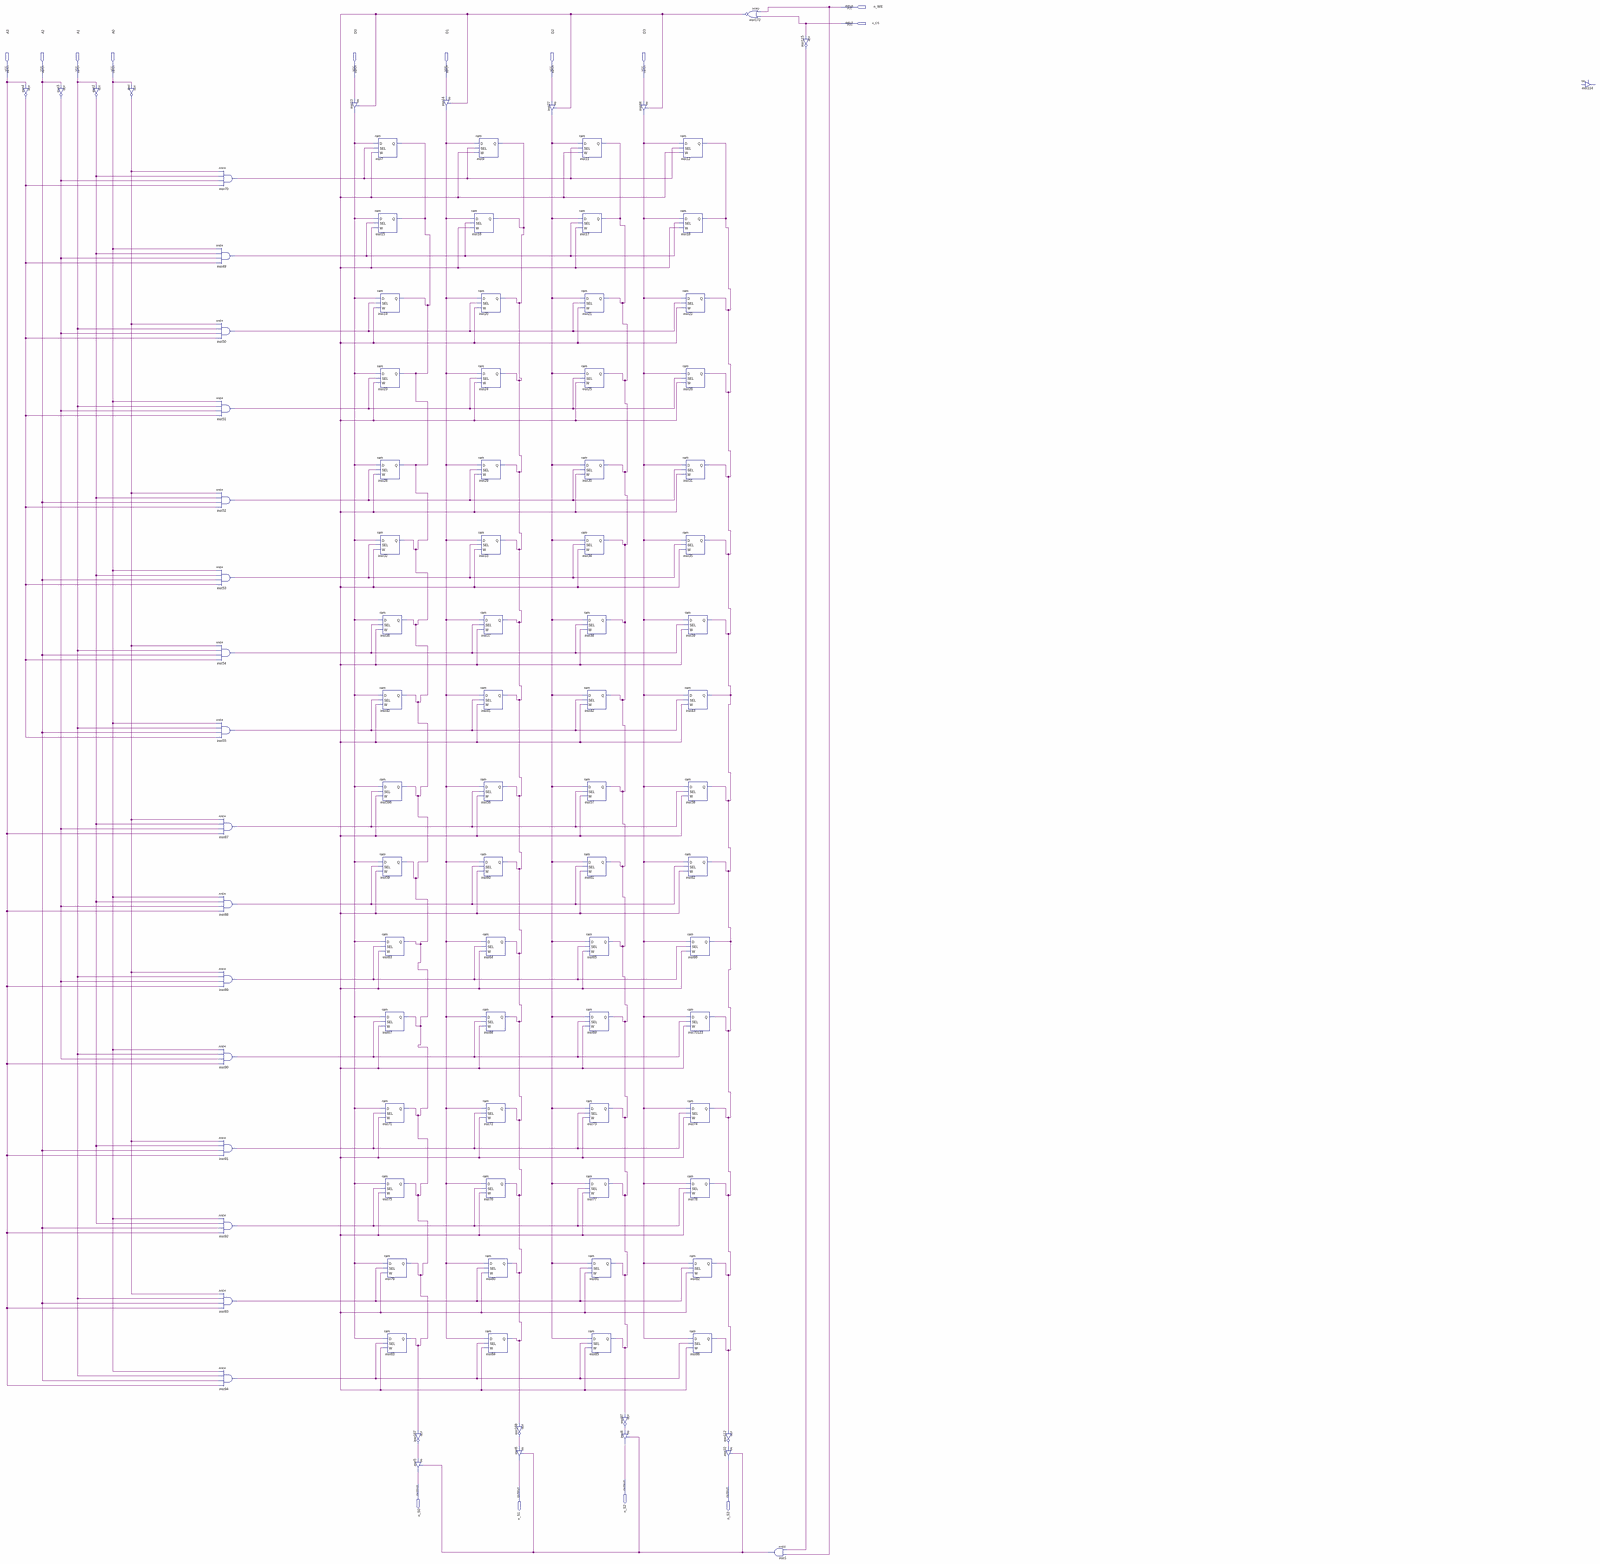
[diagram p0: schematic sheet, whole]
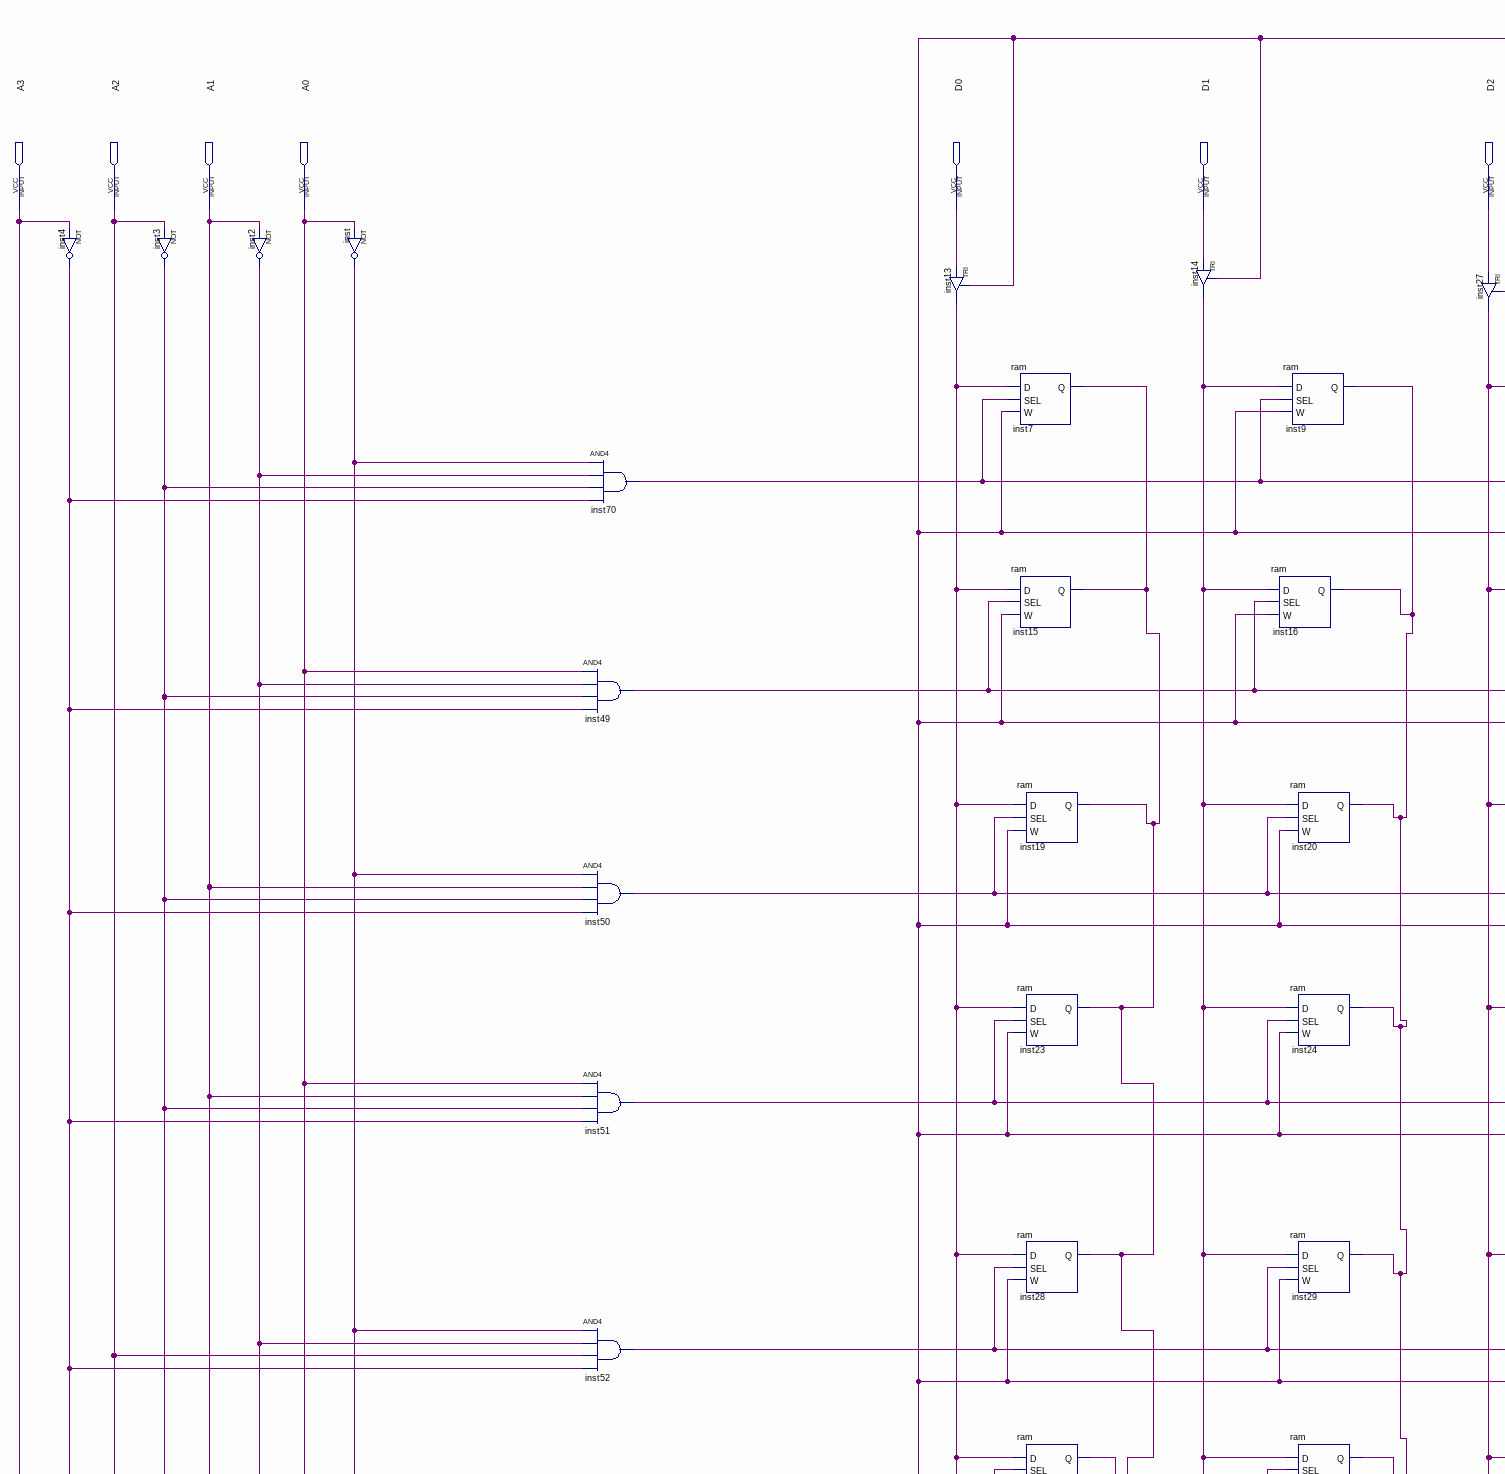
[diagram p1: schematic sheet, upper left part]
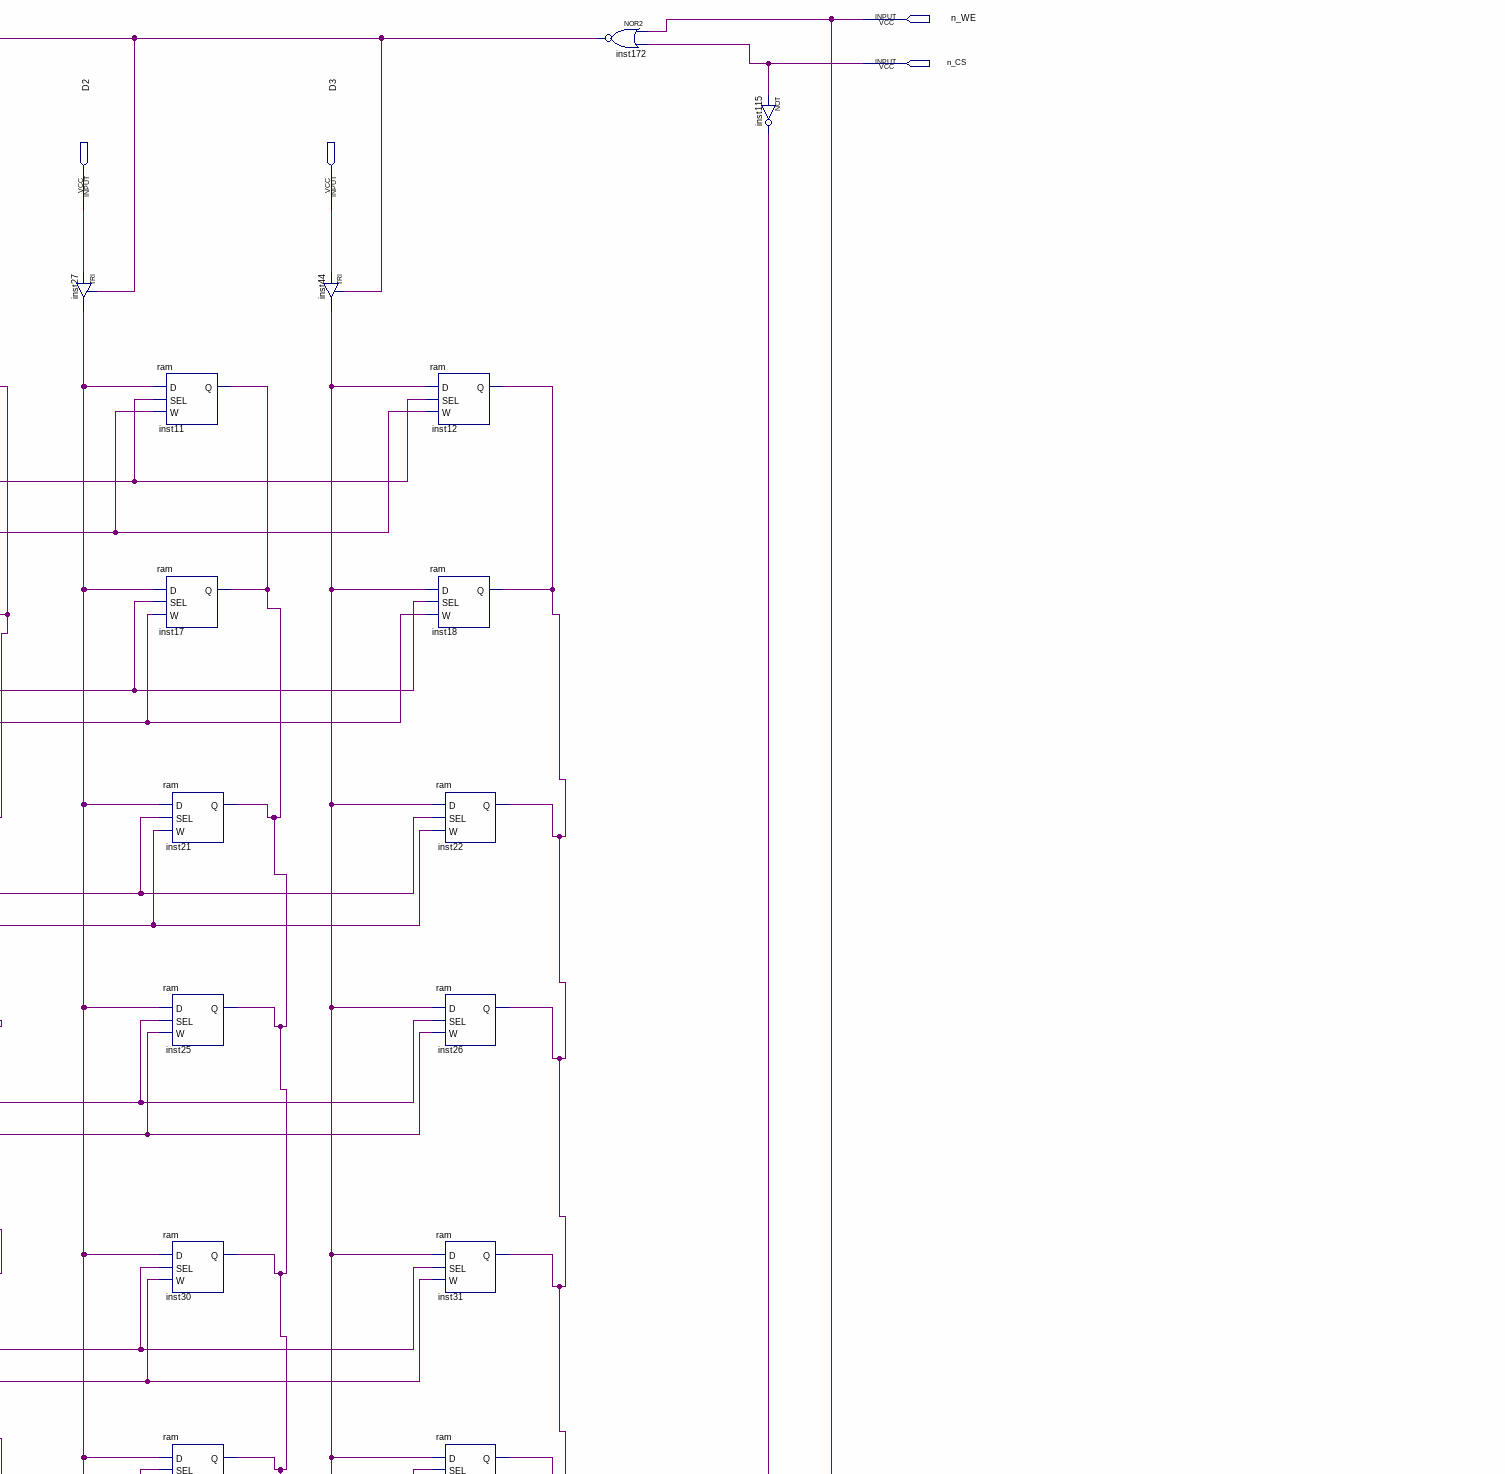
[diagram p2: schematic sheet, upper centre part]
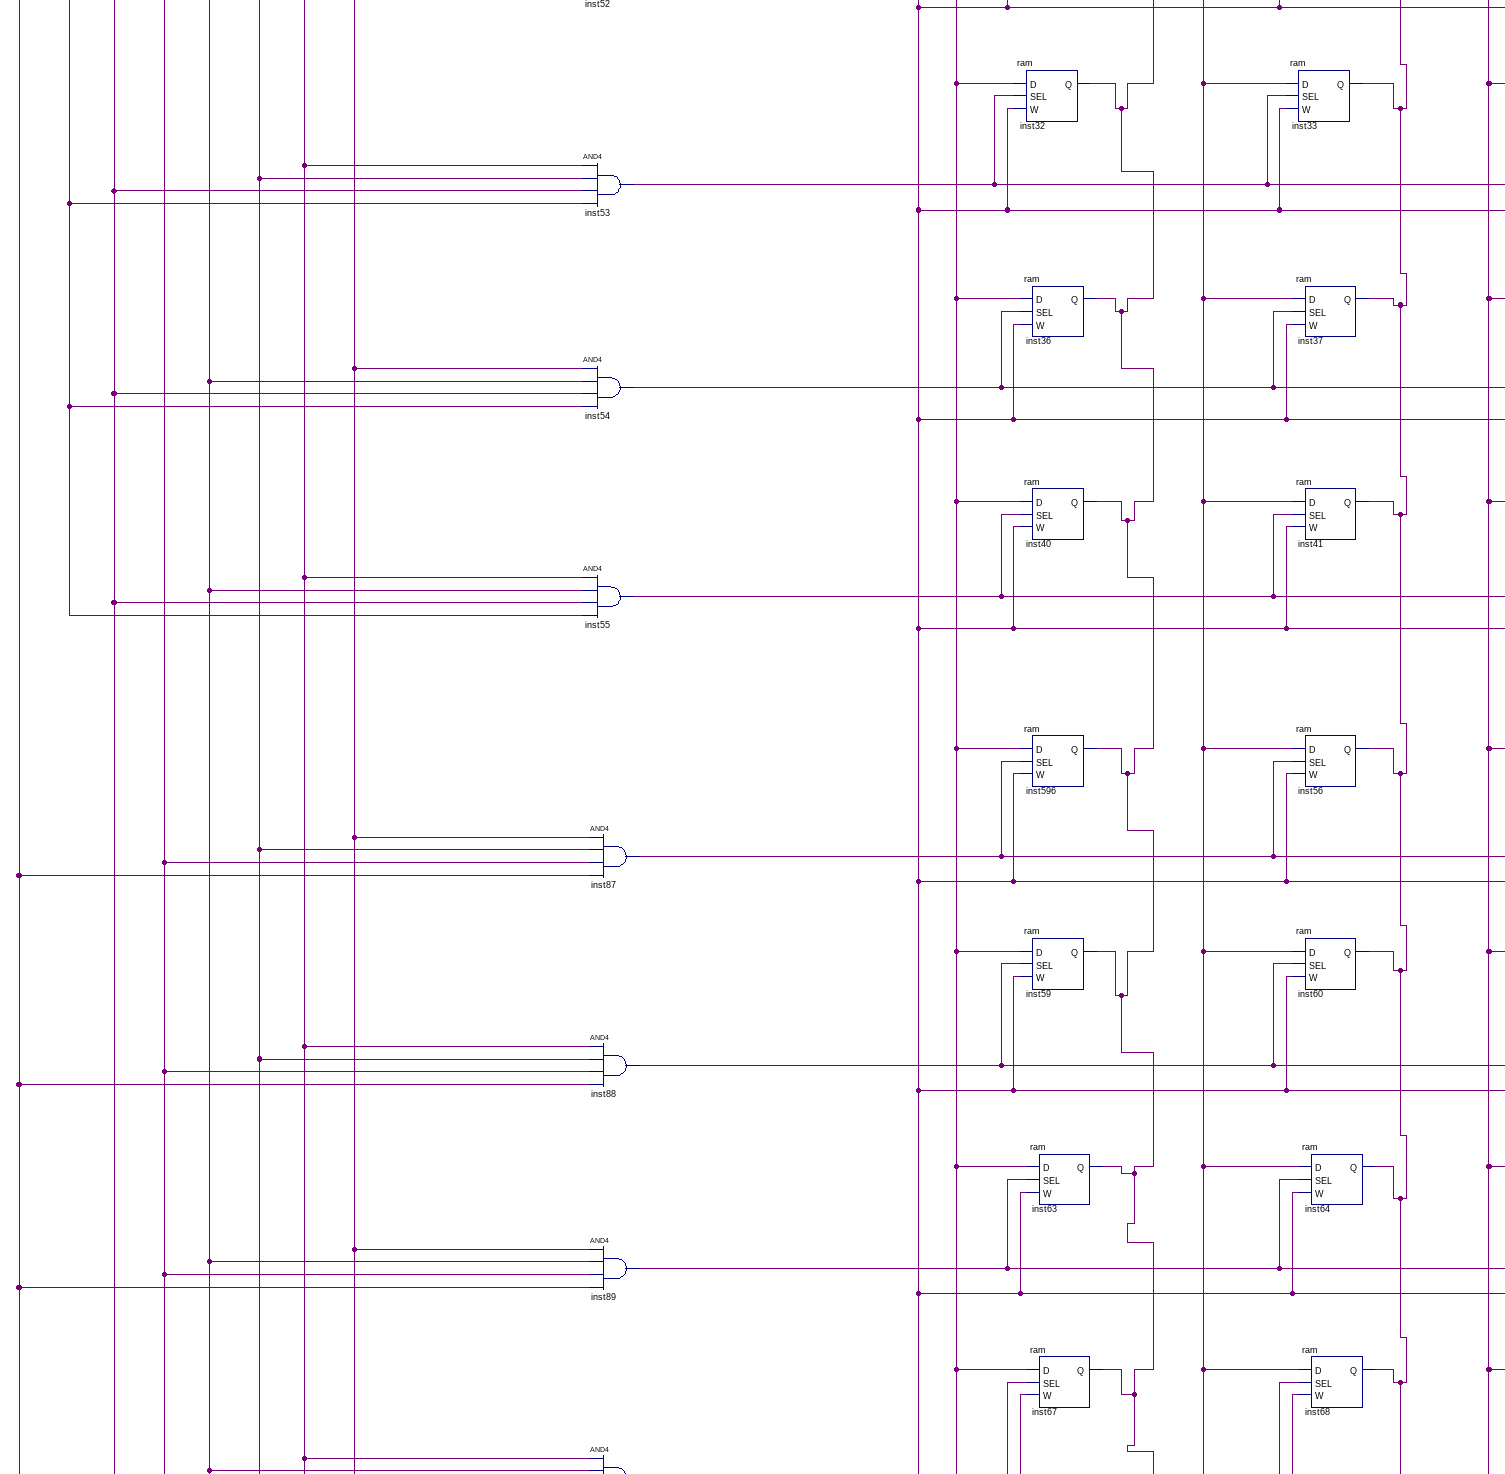
[diagram p3: schematic sheet, middle left part]
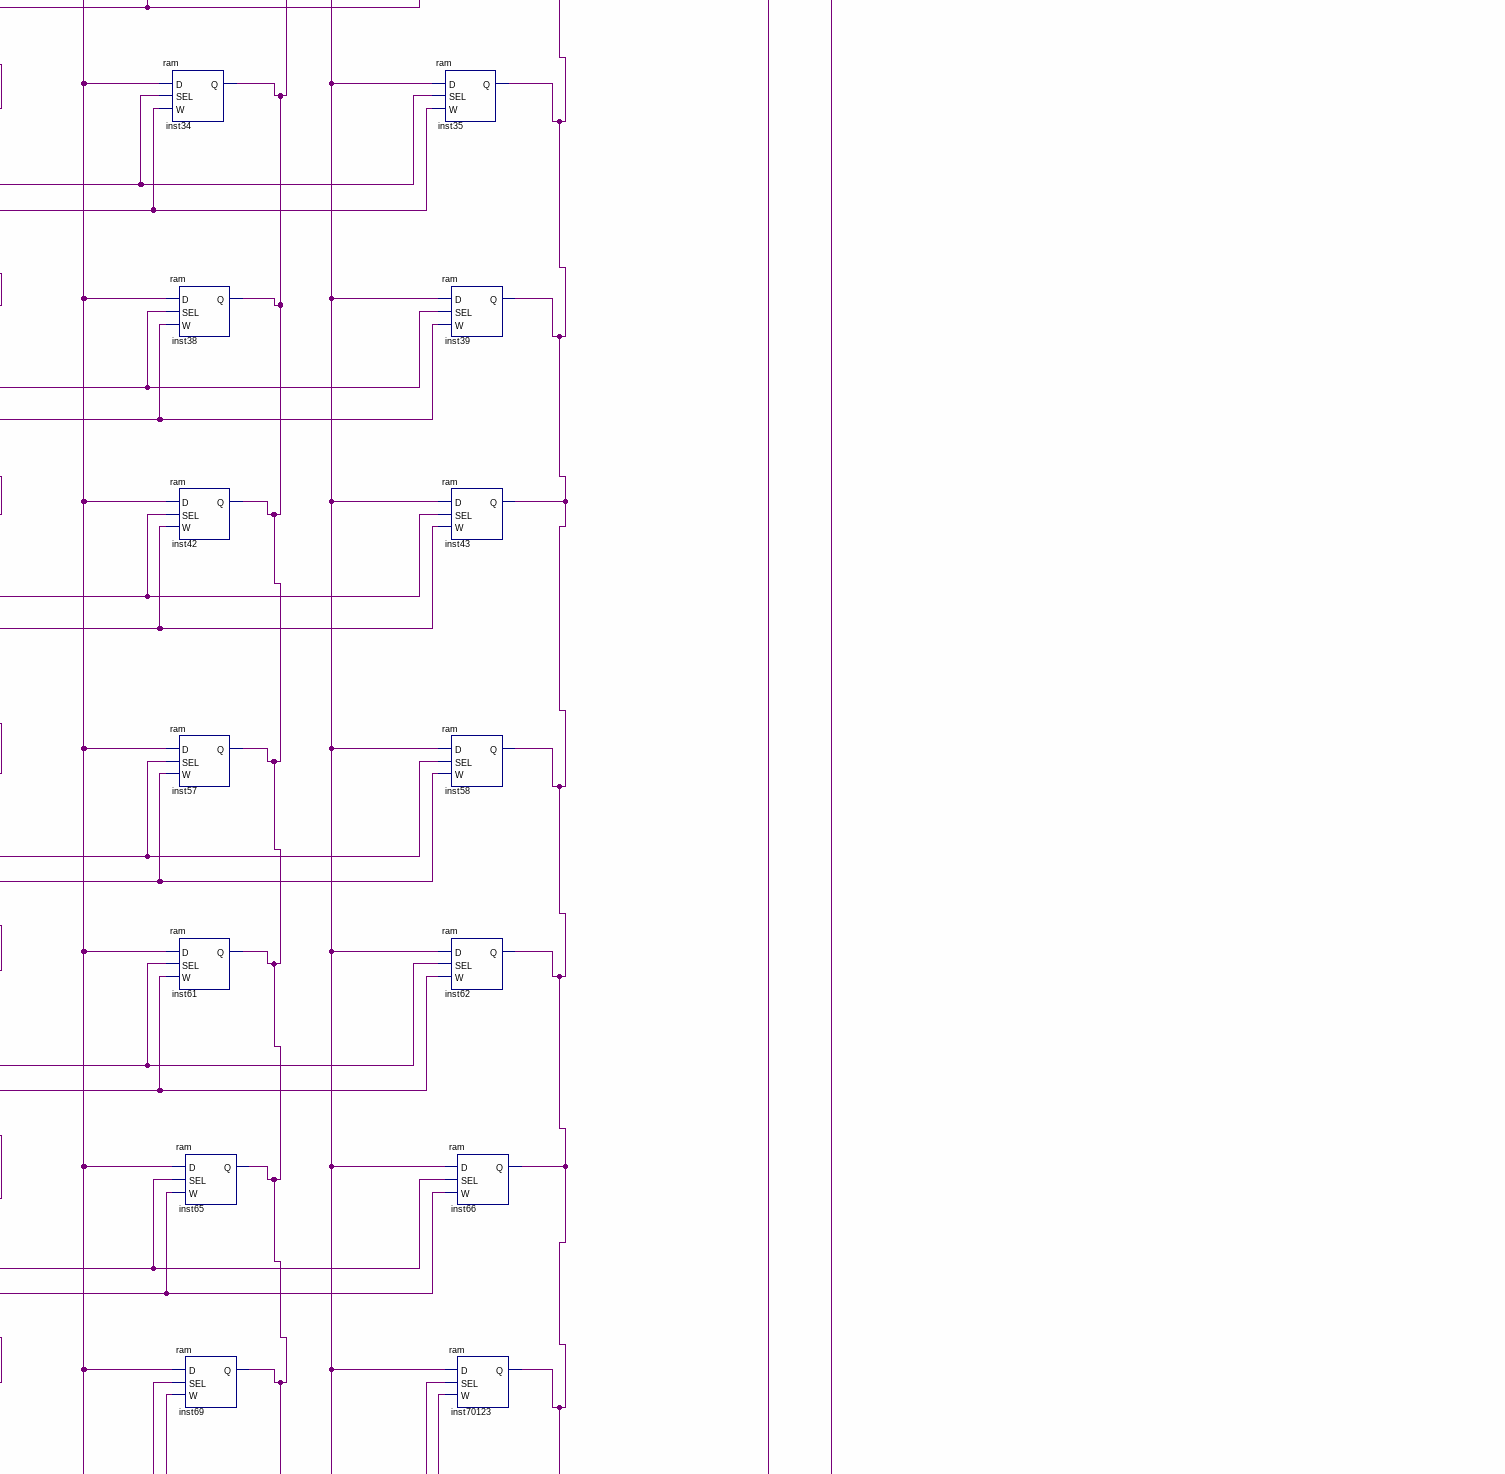
[diagram p4: schematic sheet, middle centre part]
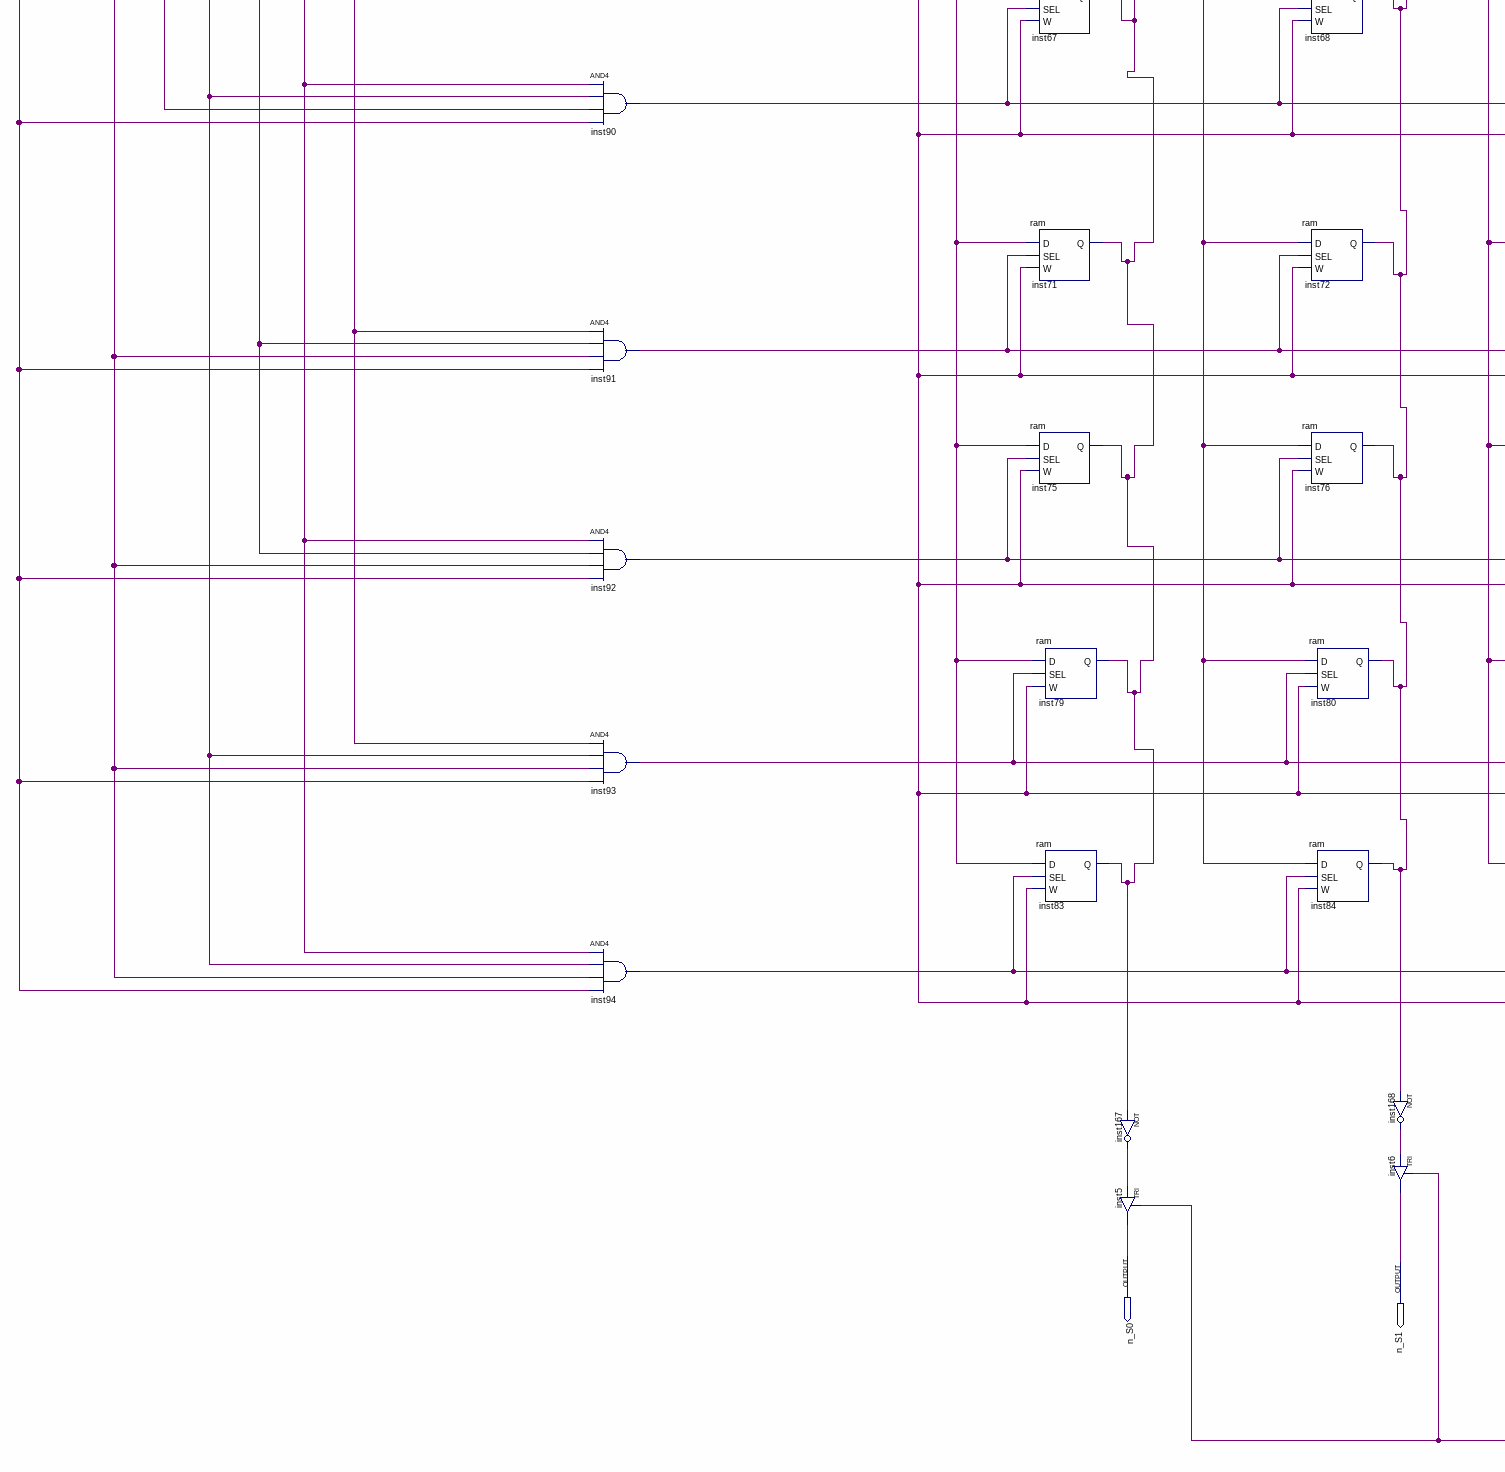
[diagram p5: schematic sheet, lower left part]
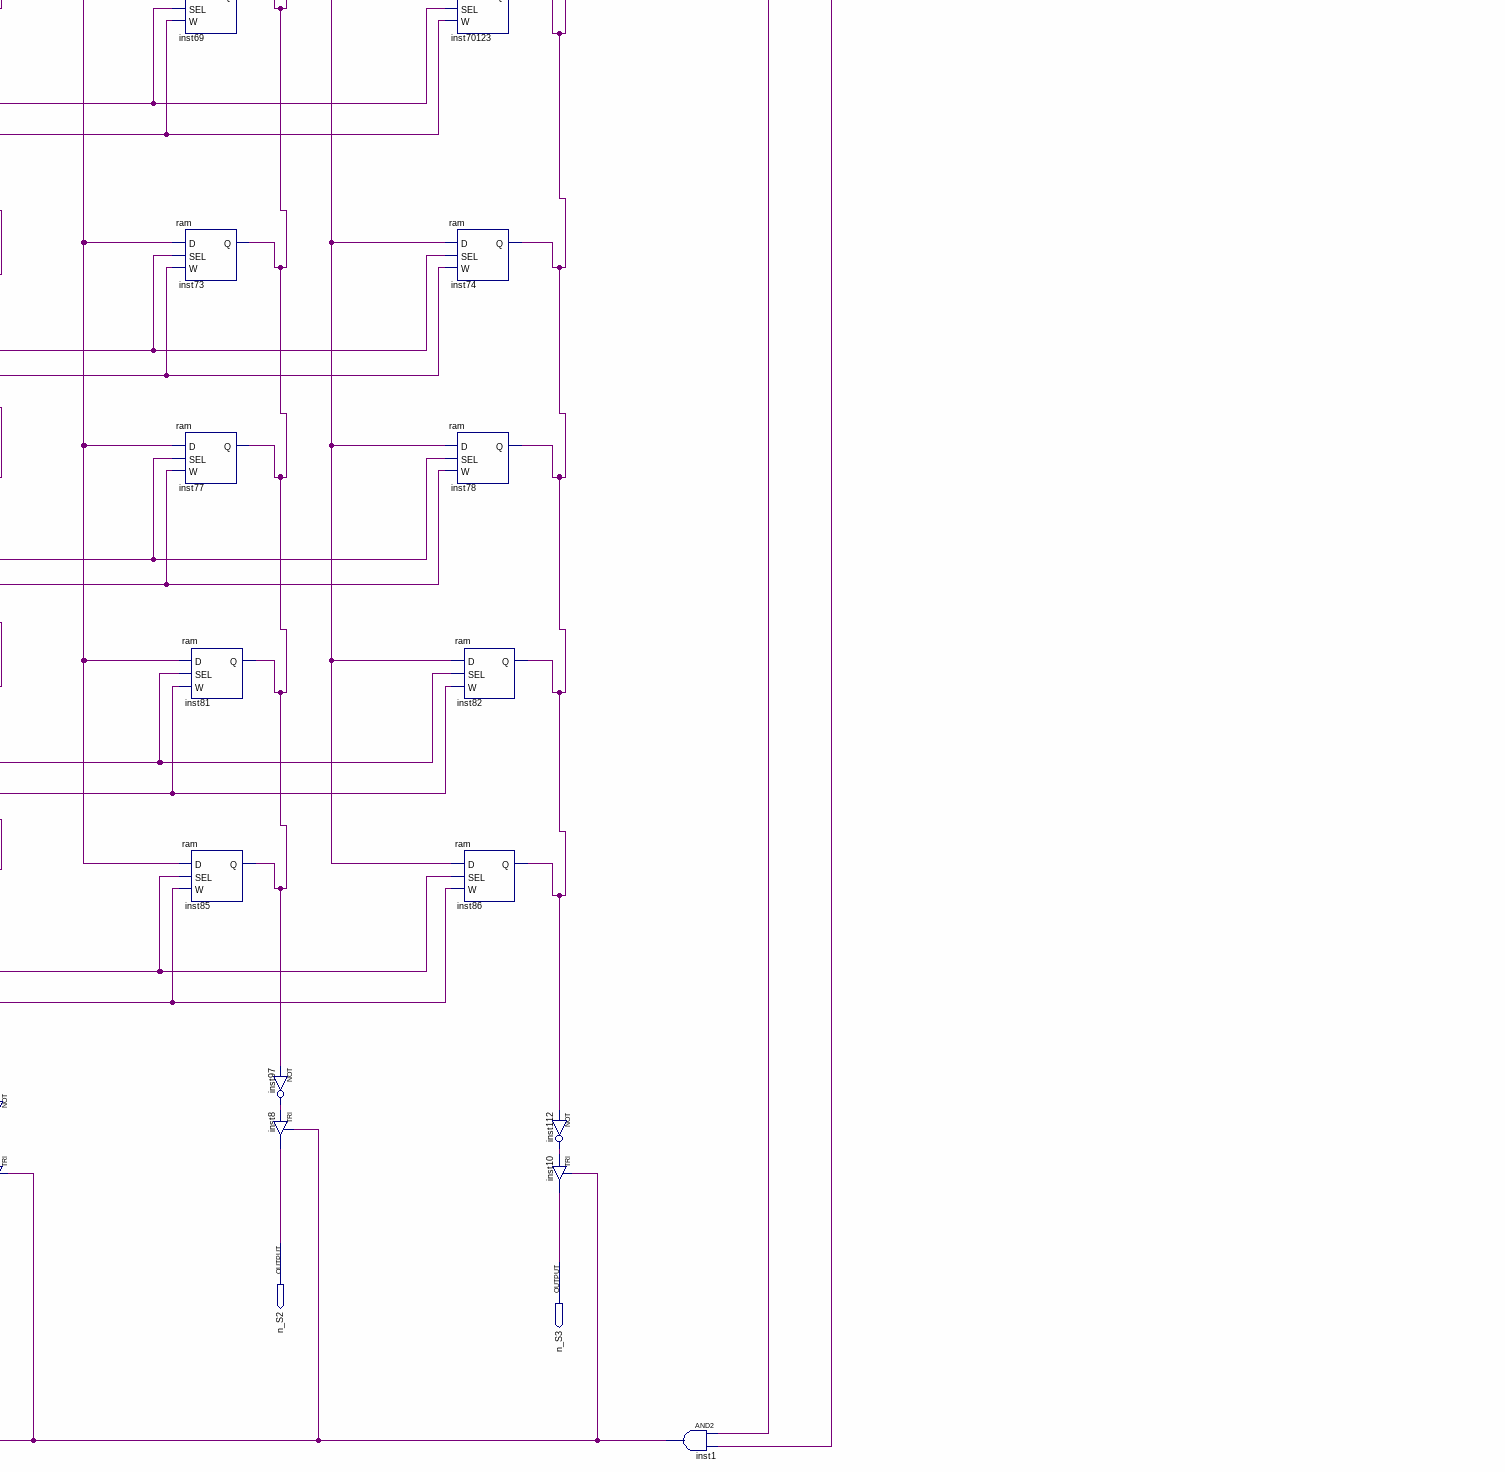
[diagram p6: schematic sheet, lower centre part]
// Quartus schematic ci74189.bdf as structural Verilog: 100 symbols, 14 pins
module ci74189 (
  input  n_WE,
  input  n_CS,
  input  A3,
  input  A2,
  input  A1,
  input  A0,
  input  D0,
  input  D1,
  input  D2,
  input  D3,
  output n_S2,
  output n_S0,
  output n_S1,
  output n_S3
);

  wire inst1_out, inst2_out, inst3_out, inst4_out, inst7_q, inst9_q, inst11_q, inst12_q, inst13_out,
       inst14_out, inst27_out, inst44_out, inst49_out, inst50_out, inst51_out, inst52_out, inst53_out,
       inst54_out, inst55_out, inst70_out, inst87_out, inst88_out, inst89_out, inst90_out, inst91_out,
       inst92_out, inst93_out, inst94_out, inst97_out, inst112_out, inst115_out, inst167_out, inst168_out,
       inst172_out, inst_out;

  not inst4 (inst4_out, A3);
  not inst3 (inst3_out, A2);
  not inst2 (inst2_out, A1);
  not inst (inst_out, A0);
  and inst70 (inst70_out, inst_out, inst2_out, inst3_out, inst4_out);
  and inst49 (inst49_out, A0, inst2_out, inst3_out, inst4_out);
  and inst50 (inst50_out, inst_out, A1, inst3_out, inst4_out);
  and inst51 (inst51_out, A0, A1, inst3_out, inst4_out);
  and inst52 (inst52_out, inst_out, inst2_out, A2, inst4_out);
  and inst53 (inst53_out, A0, inst2_out, A2, inst4_out);
  and inst54 (inst54_out, inst_out, A1, A2, inst4_out);
  and inst55 (inst55_out, A0, A1, A2, inst4_out);
  and inst87 (inst87_out, inst_out, inst2_out, inst3_out, A3);
  and inst88 (inst88_out, A0, inst2_out, inst3_out, A3);
  and inst89 (inst89_out, inst_out, A1, inst3_out, A3);
  and inst90 (inst90_out, A0, A1, inst3_out, A3);
  and inst91 (inst91_out, inst_out, inst2_out, A2, A3);
  and inst92 (inst92_out, A0, inst2_out, A2, A3);
  and inst93 (inst93_out, inst_out, A1, A2, A3);
  and inst94 (inst94_out, A0, A1, A2, A3);
  TRI inst13 (.IN(D0), .OE(inst172_out), .OUT(inst13_out));
  ram inst7 (.D(inst13_out), .SEL(inst70_out), .W(inst172_out), .Q(inst7_q));
  ram inst15 (.D(inst13_out), .SEL(inst49_out), .W(inst172_out), .Q(inst7_q));
  ram inst19 (.D(inst13_out), .SEL(inst50_out), .W(inst172_out), .Q(inst7_q));
  ram inst23 (.D(inst13_out), .SEL(inst51_out), .W(inst172_out), .Q(inst7_q));
  ram inst28 (.D(inst13_out), .SEL(inst52_out), .W(inst172_out), .Q(inst7_q));
  ram inst32 (.D(inst13_out), .SEL(inst53_out), .W(inst172_out), .Q(inst7_q));
  ram inst36 (.D(inst13_out), .SEL(inst54_out), .W(inst172_out), .Q(inst7_q));
  ram inst40 (.D(inst13_out), .SEL(inst55_out), .W(inst172_out), .Q(inst7_q));
  ram inst596 (.D(inst13_out), .SEL(inst87_out), .W(inst172_out), .Q(inst7_q));
  ram inst59 (.D(inst13_out), .SEL(inst88_out), .W(inst172_out), .Q(inst7_q));
  ram inst63 (.D(inst13_out), .SEL(inst89_out), .W(inst172_out), .Q(inst7_q));
  ram inst67 (.D(inst13_out), .SEL(inst90_out), .W(inst172_out), .Q(inst7_q));
  ram inst71 (.D(inst13_out), .SEL(inst91_out), .W(inst172_out), .Q(inst7_q));
  ram inst75 (.D(inst13_out), .SEL(inst92_out), .W(inst172_out), .Q(inst7_q));
  ram inst79 (.D(inst13_out), .SEL(inst93_out), .W(inst172_out), .Q(inst7_q));
  ram inst83 (.D(inst13_out), .SEL(inst94_out), .W(inst172_out), .Q(inst7_q));
  not inst167 (inst167_out, inst7_q);
  TRI inst5 (.IN(inst167_out), .OE(inst1_out), .OUT(n_S0));
  TRI inst14 (.IN(D1), .OE(inst172_out), .OUT(inst14_out));
  ram inst9 (.D(inst14_out), .SEL(inst70_out), .W(inst172_out), .Q(inst9_q));
  ram inst16 (.D(inst14_out), .SEL(inst49_out), .W(inst172_out), .Q(inst9_q));
  ram inst20 (.D(inst14_out), .SEL(inst50_out), .W(inst172_out), .Q(inst9_q));
  ram inst24 (.D(inst14_out), .SEL(inst51_out), .W(inst172_out), .Q(inst9_q));
  ram inst29 (.D(inst14_out), .SEL(inst52_out), .W(inst172_out), .Q(inst9_q));
  ram inst33 (.D(inst14_out), .SEL(inst53_out), .W(inst172_out), .Q(inst9_q));
  ram inst37 (.D(inst14_out), .SEL(inst54_out), .W(inst172_out), .Q(inst9_q));
  ram inst41 (.D(inst14_out), .SEL(inst55_out), .W(inst172_out), .Q(inst9_q));
  ram inst56 (.D(inst14_out), .SEL(inst87_out), .W(inst172_out), .Q(inst9_q));
  ram inst60 (.D(inst14_out), .SEL(inst88_out), .W(inst172_out), .Q(inst9_q));
  ram inst64 (.D(inst14_out), .SEL(inst89_out), .W(inst172_out), .Q(inst9_q));
  ram inst68 (.D(inst14_out), .SEL(inst90_out), .W(inst172_out), .Q(inst9_q));
  ram inst72 (.D(inst14_out), .SEL(inst91_out), .W(inst172_out), .Q(inst9_q));
  ram inst76 (.D(inst14_out), .SEL(inst92_out), .W(inst172_out), .Q(inst9_q));
  ram inst80 (.D(inst14_out), .SEL(inst93_out), .W(inst172_out), .Q(inst9_q));
  ram inst84 (.D(inst14_out), .SEL(inst94_out), .W(inst172_out), .Q(inst9_q));
  not inst168 (inst168_out, inst9_q);
  TRI inst6 (.IN(inst168_out), .OE(inst1_out), .OUT(n_S1));
  TRI inst27 (.IN(D2), .OE(inst172_out), .OUT(inst27_out));
  ram inst11 (.D(inst27_out), .SEL(inst70_out), .W(inst172_out), .Q(inst11_q));
  ram inst17 (.D(inst27_out), .SEL(inst49_out), .W(inst172_out), .Q(inst11_q));
  ram inst21 (.D(inst27_out), .SEL(inst50_out), .W(inst172_out), .Q(inst11_q));
  ram inst25 (.D(inst27_out), .SEL(inst51_out), .W(inst172_out), .Q(inst11_q));
  ram inst30 (.D(inst27_out), .SEL(inst52_out), .W(inst172_out), .Q(inst11_q));
  ram inst34 (.D(inst27_out), .SEL(inst53_out), .W(inst172_out), .Q(inst11_q));
  ram inst38 (.D(inst27_out), .SEL(inst54_out), .W(inst172_out), .Q(inst11_q));
  ram inst42 (.D(inst27_out), .SEL(inst55_out), .W(inst172_out), .Q(inst11_q));
  ram inst57 (.D(inst27_out), .SEL(inst87_out), .W(inst172_out), .Q(inst11_q));
  ram inst61 (.D(inst27_out), .SEL(inst88_out), .W(inst172_out), .Q(inst11_q));
  ram inst65 (.D(inst27_out), .SEL(inst89_out), .W(inst172_out), .Q(inst11_q));
  ram inst69 (.D(inst27_out), .SEL(inst90_out), .W(inst172_out), .Q(inst11_q));
  ram inst73 (.D(inst27_out), .SEL(inst91_out), .W(inst172_out), .Q(inst11_q));
  ram inst77 (.D(inst27_out), .SEL(inst92_out), .W(inst172_out), .Q(inst11_q));
  ram inst81 (.D(inst27_out), .SEL(inst93_out), .W(inst172_out), .Q(inst11_q));
  ram inst85 (.D(inst27_out), .SEL(inst94_out), .W(inst172_out), .Q(inst11_q));
  not inst97 (inst97_out, inst11_q);
  TRI inst8 (.IN(inst97_out), .OE(inst1_out), .OUT(n_S2));
  TRI inst44 (.IN(D3), .OE(inst172_out), .OUT(inst44_out));
  ram inst12 (.D(inst44_out), .SEL(inst70_out), .W(inst172_out), .Q(inst12_q));
  ram inst18 (.D(inst44_out), .SEL(inst49_out), .W(inst172_out), .Q(inst12_q));
  ram inst22 (.D(inst44_out), .SEL(inst50_out), .W(inst172_out), .Q(inst12_q));
  ram inst26 (.D(inst44_out), .SEL(inst51_out), .W(inst172_out), .Q(inst12_q));
  ram inst31 (.D(inst44_out), .SEL(inst52_out), .W(inst172_out), .Q(inst12_q));
  ram inst35 (.D(inst44_out), .SEL(inst53_out), .W(inst172_out), .Q(inst12_q));
  ram inst39 (.D(inst44_out), .SEL(inst54_out), .W(inst172_out), .Q(inst12_q));
  ram inst43 (.D(inst44_out), .SEL(inst55_out), .W(inst172_out), .Q(inst12_q));
  ram inst58 (.D(inst44_out), .SEL(inst87_out), .W(inst172_out), .Q(inst12_q));
  ram inst62 (.D(inst44_out), .SEL(inst88_out), .W(inst172_out), .Q(inst12_q));
  ram inst66 (.D(inst44_out), .SEL(inst89_out), .W(inst172_out), .Q(inst12_q));
  ram inst70123 (.D(inst44_out), .SEL(inst90_out), .W(inst172_out), .Q(inst12_q));
  ram inst74 (.D(inst44_out), .SEL(inst91_out), .W(inst172_out), .Q(inst12_q));
  ram inst78 (.D(inst44_out), .SEL(inst92_out), .W(inst172_out), .Q(inst12_q));
  ram inst82 (.D(inst44_out), .SEL(inst93_out), .W(inst172_out), .Q(inst12_q));
  ram inst86 (.D(inst44_out), .SEL(inst94_out), .W(inst172_out), .Q(inst12_q));
  not inst112 (inst112_out, inst12_q);
  TRI inst10 (.IN(inst112_out), .OE(inst1_out), .OUT(n_S3));
  nor inst172 (inst172_out, n_WE, n_CS);
  and inst1 (inst1_out, inst115_out, n_WE);
  not inst115 (inst115_out, n_CS);
  TRI inst114 ();  // open: IN, OE, OUT
endmodule
